# EAGLE schematic Welduino (EAGLE 9.6.2)

## Sheet 1 of 2
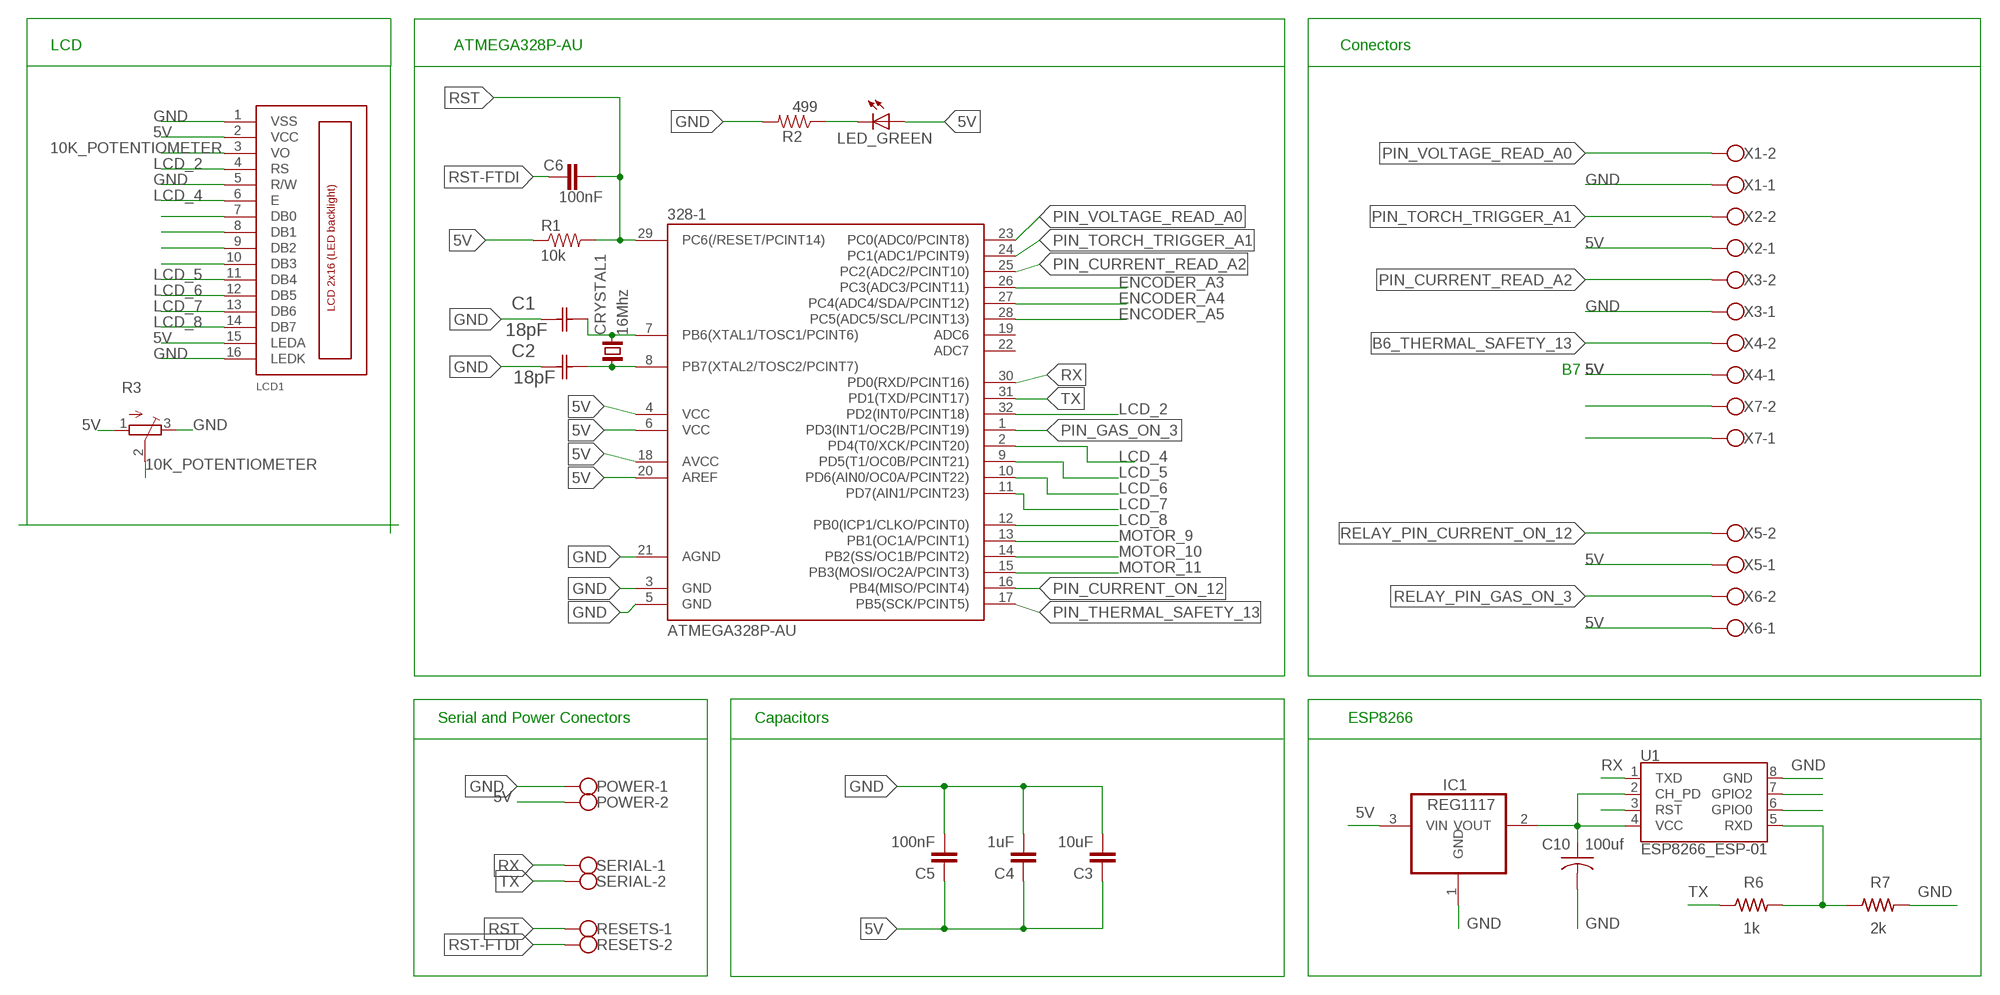
[diagram p0: schematic, sheet 1]

### Parts
328-1  ATMEGA328P-AU  ATMEGA48/88/168-AU  [TQFP32-08]
C1  18pF  0612ZC225MAT2A  [CAPC3216X178N]
C2  18pF  0612ZC225MAT2A  [CAPC3216X178N]
C3  10uF  CAP1206  [1206]
C4  1uF  CAP1206  [1206]
C5  100nF  CAP1206  [1206]
C6  100nF  CAP1206  [1206]
C10  100uf  CAP-US1206FAB  [C1206FAB]
CRYSTAL1  16Mhz  NX5032GA  [2-SMD-5X3]
IC1  REG1117  [SOT223]
LCD1  LCD_2X16_SIL  [HY-1602F]
LED_GREEN  LED1206  [1206]
POWER  W237-102  [W237-102]
R1  10k  RESISTOR1206  [1206]
R2  499  RESISTOR1206  [1206]
R3  TRIM_EU-3223J  [3223J]
R6  1k  RES-US1206FAB  [R1206FAB]
R7  2k  RES-US1206FAB  [R1206FAB]
RESETS  W237-102  [W237-102]
SERIAL  W237-102  [W237-102]
U1  ESP8266_ESP-01  [ESP8266_ESP-01]
X1  W237-102  [W237-102]
X2  W237-102  [W237-102]
X3  W237-102  [W237-102]
X4  W237-102  [W237-102]
X5  W237-102  [W237-102]
X6  W237-102  [W237-102]
X7  W237-102  [W237-102]

### Nets
5V: 328-1.4(VCC) 328-1.6(VCC) 328-1.18(AVCC) 328-1.20(AREF) C3.1 C4.1 C5.1 IC1.3(VIN) LCD1.2(VCC) LCD1.15(LEDA) LED_GREEN.1(A) POWER.2 R1.1 R3.1(A) X2.1 X4.1 X5.1 X6.1
10K_POTENTIOMETER: LCD1.3(VO) R3.2(S)
B6_THERMAL_SAFETY_13: X4.2
ENCODER_A3: 328-1.26(PC3(ADC3/PCINT11))
ENCODER_A4: 328-1.27(PC4(ADC4/SDA/PCINT12))
ENCODER_A5: 328-1.28(PC5(ADC5/SCL/PCINT13))
GND: 328-1.3(GND) 328-1.5(GND) 328-1.21(AGND) C1.1(C1) C2.1(C1) C3.2 C4.2 C5.2 C10.2 IC1.1(GND) LCD1.1(VSS) LCD1.5(R/W) LCD1.16(LEDK) POWER.1 R2.2 R3.3(E) R7.2 U1.8(GND) X1.1 X3.1
LCD_2: 328-1.32(PD2(INT0/PCINT18)) LCD1.4(RS)
LCD_4: 328-1.2(PD4(T0/XCK/PCINT20)) LCD1.6(E)
LCD_5: 328-1.9(PD5(T1/OC0B/PCINT21)) LCD1.11(DB4)
LCD_6: 328-1.10(PD6(AIN0/OC0A/PCINT22)) LCD1.12(DB5)
LCD_7: 328-1.11(PD7(AIN1/PCINT23)) LCD1.13(DB6)
LCD_8: 328-1.12(PB0(ICP1/CLKO/PCINT0)) LCD1.14(DB7)
MOTOR_9: 328-1.13(PB1(OC1A/PCINT1))
MOTOR_10: 328-1.14(PB2(SS/OC1B/PCINT2))
MOTOR_11: 328-1.15(PB3(MOSI/OC2A/PCINT3))
N$2: 328-1.7(PB6(XTAL1/TOSC1/PCINT6)) C1.2(C2) CRYSTAL1.2
N$3: U1.7(GPIO2)
N$4: U1.6(GPIO0)
N$5: R6.2 R7.1 U1.5(RXD)
N$6: C10.1 IC1.2(VOUT) U1.2(CH_PD) U1.4(VCC)
N$7: U1.3(RST)
N$9: 328-1.8(PB7(XTAL2/TOSC2/PCINT7)) C2.2(C2) CRYSTAL1.1
N$13: X7.2
N$14: X7.1
N$22: LCD1.7(DB0)
N$23: LCD1.8(DB1)
N$24: LCD1.9(DB2)
N$25: LCD1.10(DB3)
N$26: LED_GREEN.2(C) R2.1
PIN_CURRENT_ON_12: 328-1.16(PB4(MISO/PCINT4))
PIN_CURRENT_READ_A2: 328-1.25(PC2(ADC2/PCINT10)) X3.2
PIN_GAS_ON_3: 328-1.1(PD3(INT1/OC2B/PCINT19))
PIN_THERMAL_SAFETY_13: 328-1.17(PB5(SCK/PCINT5))
PIN_TORCH_TRIGGER_A1: 328-1.24(PC1(ADC1/PCINT9)) X2.2
PIN_VOLTAGE_READ_A0: 328-1.23(PC0(ADC0/PCINT8)) X1.2
RELAY_PIN_CURRENT_ON_12: X5.2
RELAY_PIN_GAS_ON_3: X6.2
RST: 328-1.29(PC6(/RESET/PCINT14)) C6.1 R1.2 RESETS.1
RST-FTDI: C6.2 RESETS.2
RX: 328-1.30(PD0(RXD/PCINT16)) SERIAL.1 U1.1(TXD)
TX: 328-1.31(PD1(TXD/PCINT17)) R6.1 SERIAL.2
Unconnected: 328-1.19(ADC6) 328-1.22(ADC7)

### Notes on the sheet
- LCD | ATMEGA328P-AU | Conectors
- B7
- Serial and Power Conectors | Capacitors | ESP8266

## Sheet 2 of 2

## Library data of the parts
328-1 = atmega8:ATMEGA48/88/168
C1 C2 = AVX_By_element14_Batch_1:0612ZC225MAT2A: Capacitor 1206; MPN: 0612ZC225MAT2A; OC_FARNELL: -; OC_NEWARK: 12N3209; SUPPLIER: AVX; TOLERANCE: ±20%; VALUE: 2.2µF; VOLTAGERATING: 10V
C3-C6 = 01_SparkFun:CAP: Capacitor Standard 0603 ceramic capacitor, and 0.1" leaded capacitor.
C10 = fab:CAP-US
CRYSTAL1 = NX5032GA(1):NX5032GA: CRYSTAL; AVAILABILITY: Unavailable; DESCRIPTION: 25MHz ±50ppm Crystal 8pF 70 Ohms 2-SMD, No Lead; MF: NDK America,; MP: NX5032GA; PACKAGE: SMD-2 NDK America,; PRICE: None
IC1 = burr-brown:REG1117: 800mA and 1A Low Dropout (LDO) Positive Regulator 1.8V, 2.5V, 2.85V, 3.3V, 5V, and Adj; MPN: REG1117; OC_FARNELL: 1097566; OC_NEWARK: 14P6981
LCD1 = lcd_2x16_led_backlight:LCD_2X16_SIL
LED_GREEN = 01_FAB_Hello:LED
POWER RESETS SERIAL X1-X7 = con-wago-500:W237-102: WAGO SCREW CLAMP; MPN: 237-102; OC_FARNELL: unknown; OC_NEWARK: 70K9898
R1 R2 = 01_SparkFun:RESISTOR: Resistor Basic schematic elements and footprints for 0603, 1206, and PTH 1/10th watt (small) resistors.
R3 = pot:TRIM_EU-: POTENTIOMETER
R6 R7 = fab:RES-US: Resistor (US Symbol) Variants with postfix FAB are widened to allow the routing of internal traces
U1 = SparkFun-RF:ESP8266_ESP-01: ESP8266 ESP-01 Module The ESP8266 WiFi Module is a self contained SOC with integrated TCP/IP protocol stack that can give any microcontroller access to your WiFi network. The ESP8266 is capable of either hosting an application or offloading all Wi-Fi networking functions from another application processor. Each ESP8266 module comes pre-programmed with an AT command set firmware, meaning, you can simply hook this up to your Arduino device and get about as much WiFi-ability as a WiFi Shield offers (and that’s just out of the box)! The ESP8266 module is an extremely cost effective board with a huge, and ever growing, community. This module has a powerful enough on-board processing and storage capability that allows it to be integrated with the sensors and other application specific devices through its GPIOs with minimal development up-front and minimal loading during runtime. Its high degree of on-chip integration allows for minimal external circuitry, including the front-end module, is designed to occupy minimal PCB area. The ESP8266 supports APSD for VoIP applications and Bluetooth co-existance interfaces, it contains a self-calibrated RF allowing it to work under all operating conditions, and requires no external RF parts. SparkFun Product Page <https://www.sparkfun.com/products/13678>; SF_ID: WRL-13678